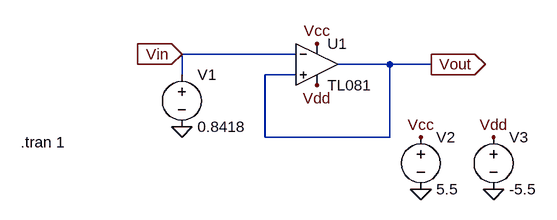
[diagram p0: schematic Buffer.asc]
Buffer.asc, the LTspice schematic file:
Version 4
SHEET 1 880 680
WIRE 144 128 -32 128
WIRE 288 144 208 144
WIRE 352 144 288 144
WIRE -32 160 -32 128
WIRE 144 160 96 160
WIRE 96 256 96 160
WIRE 288 256 288 144
WIRE 288 256 96 256
FLAG -32 240 0
FLAG 352 144 Vout
IOPIN 352 144 Out
FLAG 336 256 Vcc
FLAG 448 256 Vdd
FLAG -32 128 Vin
IOPIN -32 128 In
FLAG 336 336 0
FLAG 448 336 0
FLAG 176 112 Vcc
FLAG 176 176 Vdd
SYMBOL voltage -32 144 R0
WINDOW 123 24 124 Left 2
WINDOW 39 0 0 Left 2
SYMATTR InstName V1
SYMATTR Value 0.8418
SYMBOL voltage 336 240 R0
WINDOW 123 0 0 Left 2
WINDOW 39 0 0 Left 2
SYMATTR InstName V2
SYMATTR Value 5.5
SYMBOL voltage 448 240 R0
WINDOW 123 0 0 Left 2
WINDOW 39 0 0 Left 2
SYMATTR InstName V3
SYMATTR Value -5.5
SYMBOL Opamps\\TL081 176 80 R0
WINDOW 3 85 96 Right 2
SYMATTR InstName U1
TEXT -280 264 Left 2 !.tran 1

The netlist it stands for:
* Buffer.asc
V1 Vin 0 0.8418
V2 Vcc 0 5.5
V3 Vdd 0 -5.5
XU1 Vout Vin Vcc Vdd Vout TL081  ; pins In+ In- V+ V- OUT
.tran 1
.backanno
.end